# Altium schematic sheet Power.SchDoc
size A4
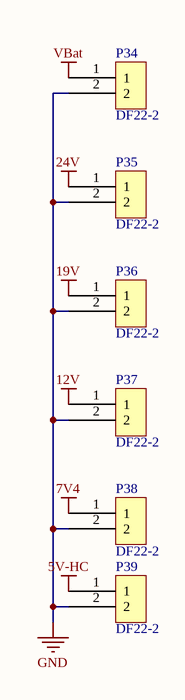
[diagram p0: Power.SchDoc]

## Parts
P34  DF22-2  [DF22-2]
P35  DF22-2  [DF63]
P36  DF22-2  [DF63]
P37  DF22-2  [DF63]
P38  DF22-2  [DF63]
P39  DF22-2  [DF63]

## Nets
5V-HC: P39.1
7V4: P38.1
12V: P37.1
19V: P36.1
24V: P35.1
GND: P34.2 P35.2 P36.2 P37.2 P38.2 P39.2
VBat: P34.1

## Library data of the parts
P34-P39 = DF22-2: CONN HEADER 2POS 7.92MM PCB TIN